# EAGLE design RingerPro2 (EAGLE 9.6.2)
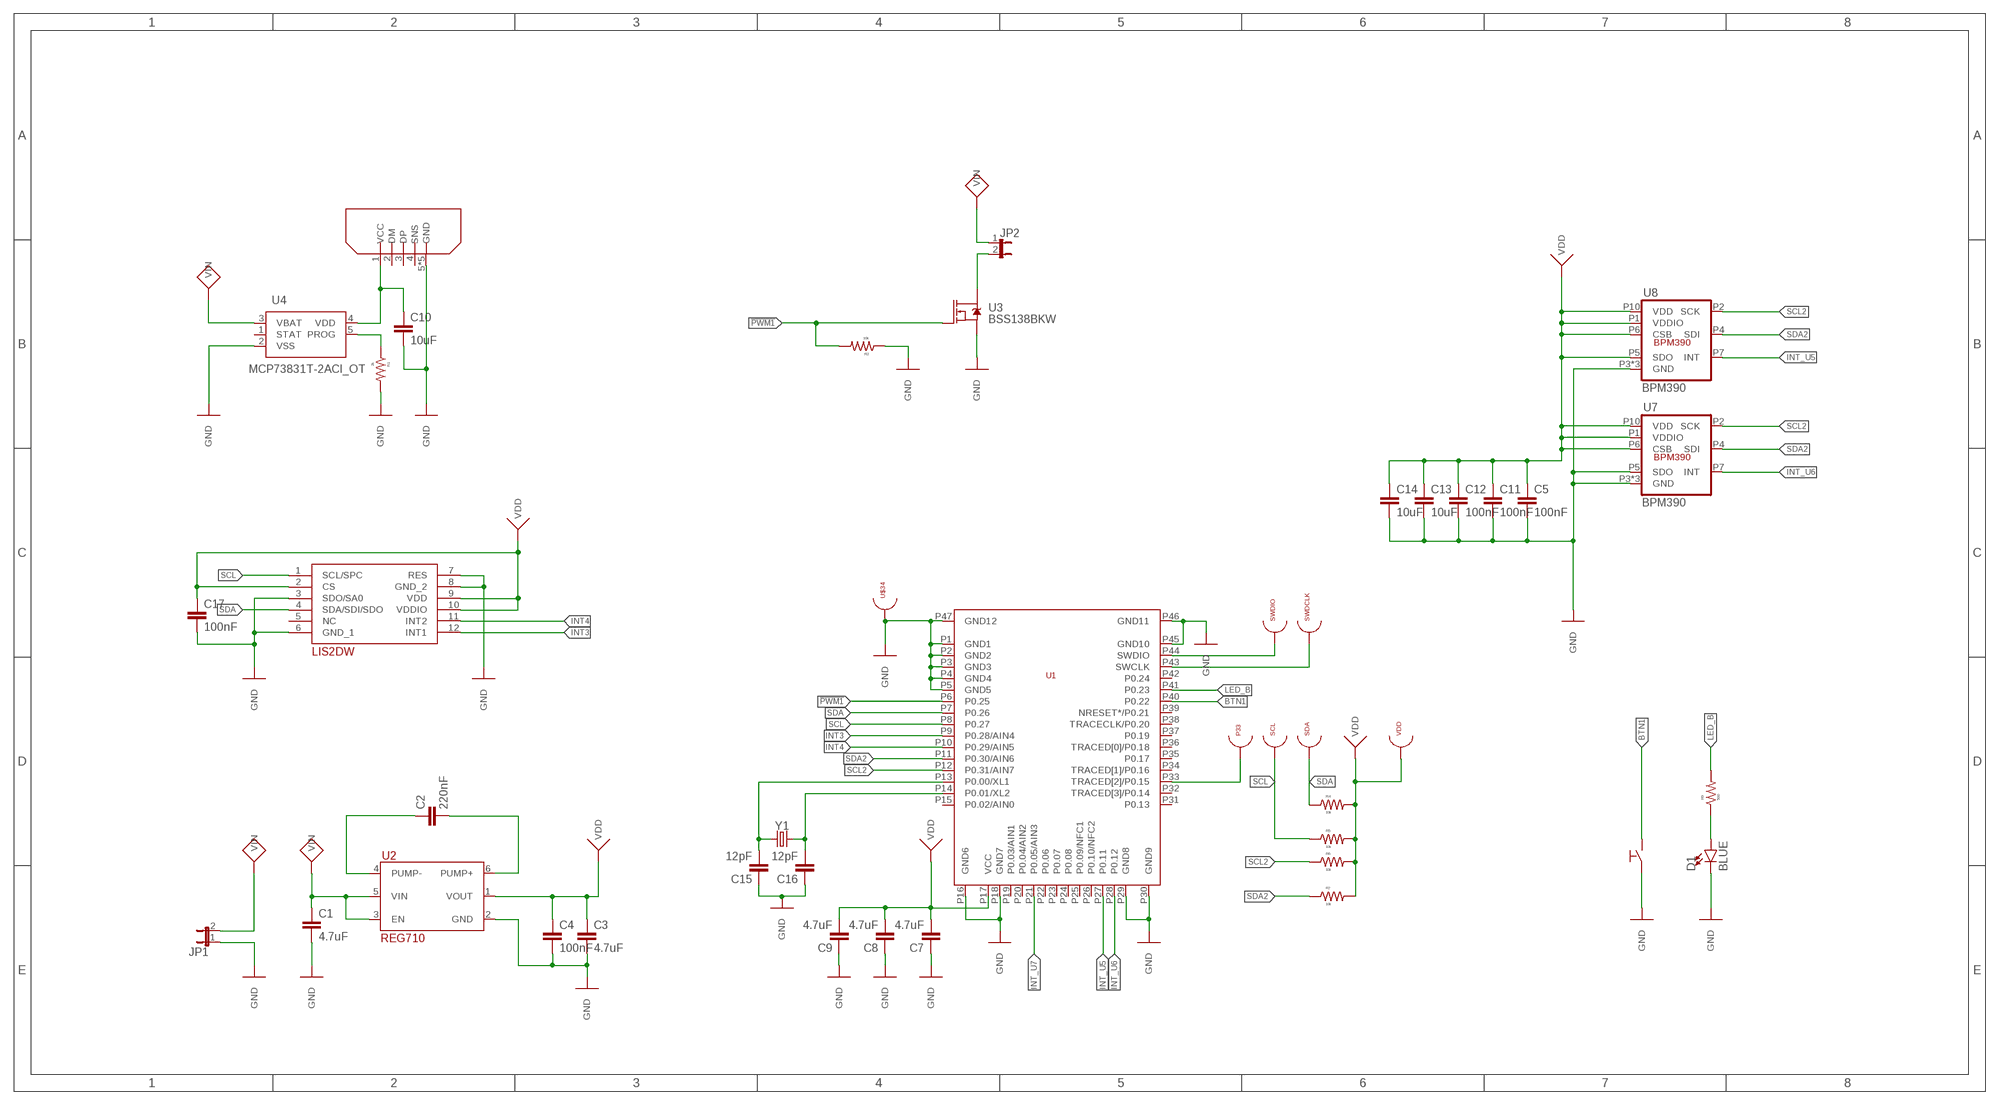
[diagram p0: schematic, sheet 1]

## Parts
C1  4.7uF  CAPACITOR0603  [C0603]
C2  220nF  CAPACITOR0603  [C0603]
C3  4.7uF  CAPACITOR0603  [C0603]
C4  100nF  CAPACITOR0603  [C0603]
C5  100nF  CAPACITOR0603  [C0603]
C7  4.7uF  CAPACITOR0603  [C0603]
C8  4.7uF  CAPACITOR0603  [C0603]
C9  4.7uF  CAPACITOR0603  [C0603]
C10  10uF  CAPACITOR0603  [C0603]
C11  100nF  CAPACITOR0603  [C0603]
C12  100nF  CAPACITOR0603  [C0603]
C13  10uF  CAPACITOR0603  [C0603]
C14  10uF  CAPACITOR0603  [C0603]
C15  12pF  CAPACITOR0603  [C0603]
C16  12pF  CAPACITOR0603  [C0603]
C17  100nF  CAPACITOR0603  [C0603]
D1  BLUE  LED-BLUE0603  [LED-0603]
IC1  LIS2DW12TR  [LGA-12]
JP1  JP1E  [JP1]
JP2  JP1E  [JP1]
P33  TESTPOINT_22  [TESTPOINT_22]
R1  2k  RESISTOR0603  [R0603]
R2  10k  RESISTOR0603  [R0603]
R4  10k  RESISTOR0603  [R0603]
R5  10k  RESISTOR0603  [R0603]
R6  10k  RESISTOR0603  [R0603]
R7  10k  RESISTOR0603  [R0603]
R9  500  RESISTOR0603  [R0603]
SCL  TESTPOINT_22  [TESTPOINT_22]
SDA  TESTPOINT_22  [TESTPOINT_22]
SPST1  PTS526SK08  [PTS526SKG15SMTR2LFS]
SWDCLK  TESTPOINT_22  [TESTPOINT_22]
SWDIO  TESTPOINT_22  [TESTPOINT_22]
U1  BMD-300  [BMD-300]
U2  REG710  [SOT457]
U3  BSS138BKW  [SOT65P210X110-3N]
U4  MCP73831T-2ACI_OT  [SOT95P270X145-5N]
U7  BPM390  [BPM390]
U8  BPM390  [BPM390]
U$23  ZX80B5P  [ZX80B5P]
U$34  TESTPOINT_22  [TESTPOINT_22]
VDD  TESTPOINT_22  [TESTPOINT_22]
Y1  CRYSTALSMD-3.2X1.5  [CRYSTAL-SMD-3.2X1.5MM]

## Nets
!PWM1: R2.2 U1.P6(P0.25) U3.1(G)
BTN1: SPST1.3 SPST1.4 U1.P40(P0.22)
GND: C1.2 C3.2 C4.2 C5.2 C7.1 C8.1 C9.1 C10.2 C11.2 C12.2 C13.2 C14.2 C15.1 C16.1 C17.2 D1.C IC1.3(SDO/SA0) IC1.6(GND_1) IC1.7(RES) IC1.8(GND_2) JP1.1 R1.2 R2.1 SPST1.1 SPST1.2 U1.P1(GND1) U1.P2(GND2) U1.P3(GND3) U1.P4(GND4) U1.P5(GND5) U1.P16(GND6) U1.P18(GND7) U1.P29(GND8) U1.P30(GND9) U1.P45(GND10) U1.P46(GND11) U1.P47(GND12) U2.2(GND) U3.2(S) U4.2(VSS) U7.P3(GND) U7.P5(SDO) U7.P8(GND) U7.P9(GND) U8.P3(GND) U8.P8(GND) U8.P9(GND) U$23.5(GND) U$23.GND1(GND) U$23.GND2(GND) U$23.GND3(GND) U$23.GND4(GND) U$34.P$1
INT3: IC1.12(INT1) U1.P9(P0.28/AIN4)
INT4: IC1.11(INT2) U1.P10(P0.29/AIN5)
INT_U5: U1.P27(P0.11) U8.P7(INT)
INT_U6: U1.P28(P0.12) U7.P7(INT)
INT_U7: U1.P21(P0.05/AIN3)
LED_B: R9.2 U1.P41(P0.23)
N$3: C2.1 U2.4(PUMP-)
N$4: C2.2 U2.6(PUMP+)
N$5: C10.1 U4.4(VDD) U$23.1(VCC)
N$6: C15.2 U1.P13(P0.00/XL1) Y1.P$1
N$7: R1.1 U4.5(PROG)
N$8: JP2.2 U3.3(D)
N$9: C16.2 U1.P14(P0.01/XL2) Y1.P$2
N$10: P33.P$1 U1.P33(TRACED[2]/P0.15)
N$11: D1.A R9.1
SCL: IC1.1(SCL/SPC) R5.1 SCL.P$1 U1.P8(P0.27)
SCL2: R6.1 U1.P12(P0.31/AIN7) U7.P2(SCK) U8.P2(SCK)
SDA: IC1.4(SDA/SDI/SDO) R4.1 SDA.P$1 U1.P7(P0.26)
SDA2: R7.1 U1.P11(P0.30/AIN6) U7.P4(SDI) U8.P4(SDI)
SWCLK: SWDCLK.P$1 U1.P43(SWCLK)
SWDIO: SWDIO.P$1 U1.P44(SWDIO)
VDD: C3.1 C4.1 C5.1 C7.2 C8.2 C9.2 C11.1 C12.1 C13.1 C14.1 C17.1 IC1.2(CS) IC1.9(VDD) IC1.10(VDDIO) R4.2 R5.2 R6.2 R7.2 U1.P17(VCC) U2.1(VOUT) U7.P1(VDDIO) U7.P6(CSB) U7.P10(VDD) U8.P1(VDDIO) U8.P5(SDO) U8.P6(CSB) U8.P10(VDD) VDD.P$1
VIN: C1.1 JP1.2 JP2.1 U2.3(EN) U2.5(VIN) U4.3(VBAT)
Unconnected: IC1.5(NC) U1.P15(P0.02/AIN0) U1.P19(P0.03/AIN1) U1.P20(P0.04/AIN2) U1.P22(P0.06) U1.P23(P0.07) U1.P24(P0.08) U1.P25(P0.09/NFC1) U1.P26(P0.10/NFC2) U1.P31(P0.13) U1.P32(TRACED[3]/P0.14) U1.P34(TRACED[1]/P0.16) U1.P35(P0.17) U1.P36(TRACED[0]/P0.18) U1.P37(P0.19) U1.P38(TRACECLK/P0.20) U1.P39(NRESET*/P0.21) U1.P42(P0.24) U4.1(STAT) U$23.2(DM) U$23.3(DP) U$23.4(SNS)

## Library data of the parts
C1-C5 C7-C17 = Passives:CAPACITOR: Capacitor
D1 = SparkFun-LED:LED-BLUE: Blue SMD LED Used in manufacturing of various products at SparkFun Packages: 0603 - SMD 0603 package [Product Link] <http://www.digikey.com/product-detail/en/SMLE12BC7TT86/511-1589-2-ND/1641808> 1206 - SMD1206 package [Product Link] <http://www.digikey.com/product-detail/en/lite-on-inc/LTST-C150TBKT/160-1643-1-ND/573584> SparkFun Products: ESP8266 Thing-Dev Board <https://www.sparkfun.com/products/13711> RedBoard <https://www.sparkfun.com/products/12757>; PROD_ID: DIO-08575
IC1 = Accelerometers:LIS2DW12TR: Accelerometers MEMS digital output motion sensor:high-performance ultra-low-power 3-axis "femto" accelerometer Source: Datasheet <https://componentsearchengine.com/Datasheets/1/LIS2DW12TR.pdf>; DESCRIPTION: Accelerometers MEMS digital output motion sensor:high-performance ultra-low-power 3-axis "femto" accelerometer; HEIGHT: mm; MANUFACTURER_NAME: STMicroelectronics; MANUFACTURER_PART_NUMBER: LIS2DW12TR; MOUSER_PART_NUMBER: 511-LIS2DW12TR; MOUSER_PRICE-STOCK: https://www.mouser.com/Search/Refine.aspx?Keyword=511-LIS2DW12TR
JP1 JP2 = jumper:JP1E: JUMPER
P33 SCL SDA SWDCLK SWDIO U$34 VDD = test_points:TESTPOINT_22
R1 R2 R4-R7 R9 = Passives:RESISTOR: Resistor
SPST1 = SPST:PTS526SK08: Interrupteurs de contact 50mA 12VDC, 5.2x5.2mm, 0.8mm H, 260gf, G leads, No ground pin, no actuator Button SPST; MTN: 611-PTS526SK08SMTR2L
U1 = Rigado:BMD-300
U2 = DCDC:REG710: REG710xx Buck-Boost Charge Pump with up to 60-mA Output Current
U3 = BSS138:BSS138BKW: N-channel Trench MOSFET; MPN: BSS138BKW; OC_FARNELL: 2053836; OC_NEWARK: 61T7488; PACKAGE: SOT-23-3; SUPPLIER: NXP
U4 = Battery:MCP73831T-2ACI_OT: Li-Ion Charge Controller 4.2V SOT23-5 Source: Datasheet <http://ww1.microchip.com/downloads/en/DeviceDoc/20001984g.pdf>; DESCRIPTION: Li-Ion Charge Controller 4.2V SOT23-5; HEIGHT: 1.45mm; MANUFACTURER_NAME: Microchip; MANUFACTURER_PART_NUMBER: MCP73831T-2ACI/OT; MOUSER_PART_NUMBER: 579-MCP73831T-2ACIOT; MOUSER_PRICE-STOCK: https://www.mouser.co.uk/ProductDetail/Microchip-Technology/MCP73831T-2ACI-OT?qs=yUQqVecv4qvbBQBGbHx0Mw%3D%3D
U7 U8 = Barometers:BPM390: High precision pressure sensor
U$23 = USB:ZX80B5P
Y1 = SparkFun-Clocks:CRYSTAL: Crystals (Generic) These are passive quartz crystals, which can be used as a clock source for a microcontroller. Crystal's are two-terminal devices. They require external "load" capacitors to generate an oscillating signal.

## Net classes
0 default: width 0.178 mm, clearance 0.152 mm

## Board
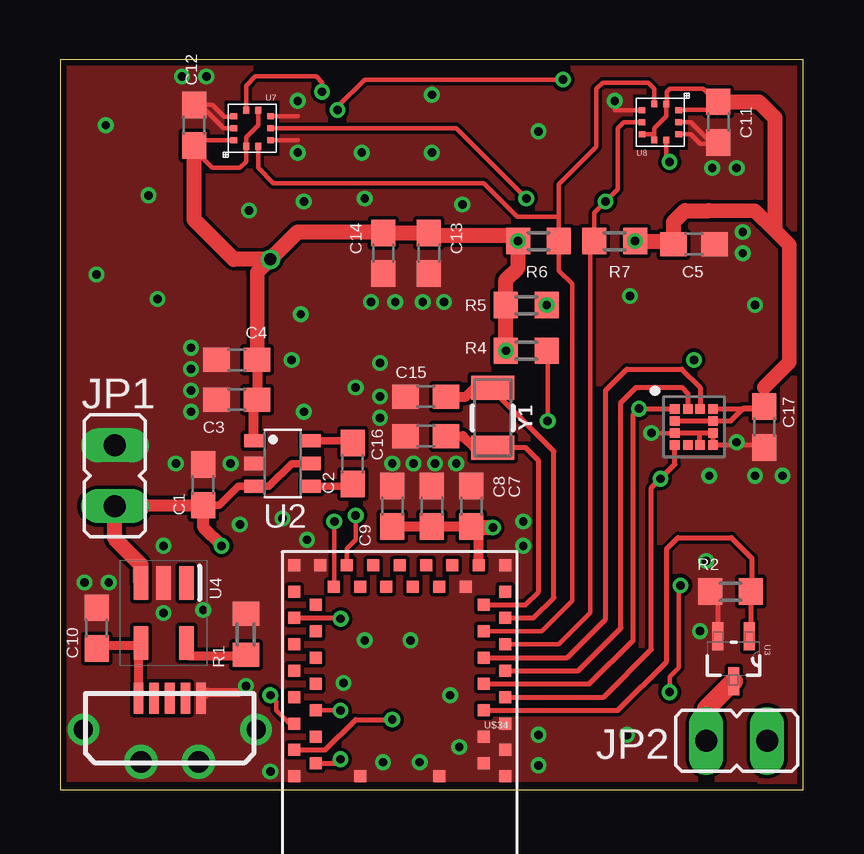
[diagram p1: board, top side]
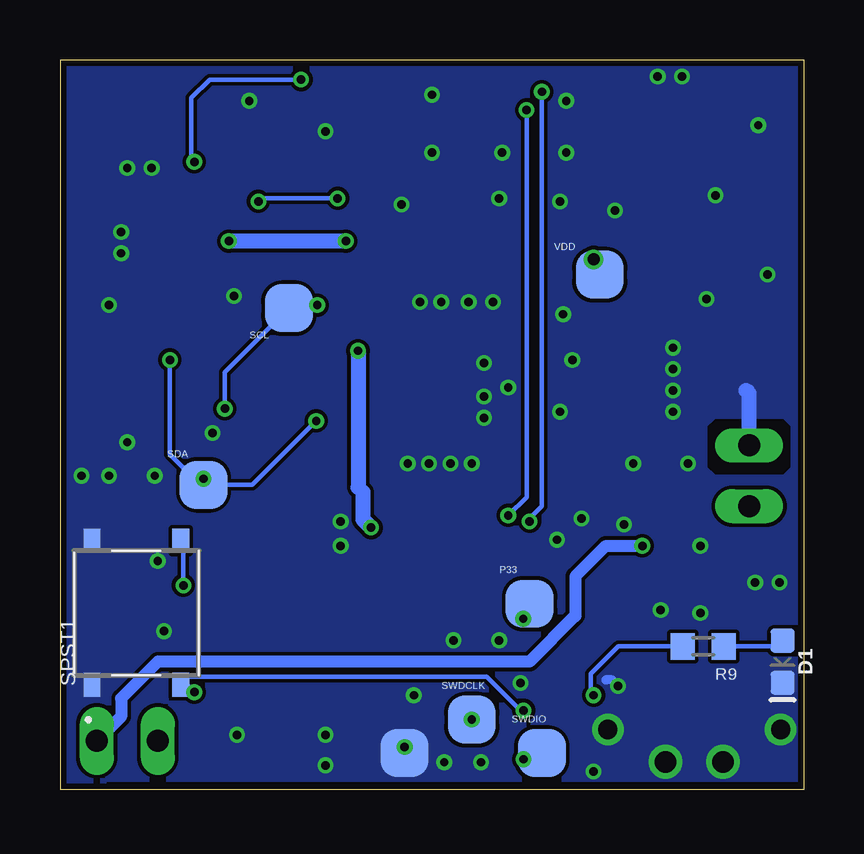
[diagram p2: board, bottom side, seen from below]

Size 30.97 x 30.4 mm. Coordinates in mm from the lower left corner, seen from the top.
Outline: 0,0 30.97,0 30.97,30.4 0,30.4 0,0
Copper layers (1*16): Top 0.035mm / dielectric 1.5mm / Bottom 0.035mm
Design rules "SeeedStudio_2layer_DRU_no_angle_20140221": minimum track width 6mil, minimum drill 12mil, track to track 6mil, track to pad 6mil, pad to pad 6mil, via to via 6mil, smd to smd 0mil, copper to edge 10mil, drill to drill 10mil, minimum pad ring 10mil, minimum via ring 6mil, stop-mask expansion 2mil, vias tented up to drill 100mil, thermal gap 10mil
tRestrict: area 6.9,26.4 to 9.1,28.7; area 23.9,26.7 to 26.2,29; area 25.1,13.8 to 27.7,16.4

### Footprints (pad centres in the part's own frame; a part is rotated, then mirrored left to right if it is on the bottom)
C0603 = smd 1.1 x 1: 1 -0.85,0; 2 0.85,0
LED-0603 = smd 1 x 1: A -0.877,0; C 0.877,0
LGA-12 = smd 0.4 x 0.4: 1 -0.8,0.75; 2 -0.8,0.25; 3 -0.8,-0.25; 4 -0.8,-0.75; 5 -0.25,-0.75; 6 0.25,-0.75; 7 0.8,-0.75; 8 0.8,-0.25; 9 0.8,0.25; 10 0.8,0.75; 11 0.25,0.75; 12 -0.25,0.75
JP1 = drill 0.914 long: 1 0,-1.27; 2 0,1.27
TESTPOINT_22 = smd 2 x 2: P$1 0,0
R0603 = smd 1 x 1.1: 1 -0.85,0; 2 0.85,0
PTS526SKG15SMTR2LFS = smd 1 x 0.7: 1 -3,1.85; 2 3,1.85; 3 -3,-1.85; 4 3,-1.85
BMD-300 = smd 0.5 x 0.5: P1 0.5,9.35; P2 1.4,8.8; P3 0.5,8.25; P4 1.4,7.7; P5 0.5,7.15; P6 1.4,6.6; P7 0.5,6.05; P8 1.4,5.5; P9 0.5,4.95; P10 1.4,4.4; P11 0.5,3.85; P12 1.4,3.3; P13 0.5,2.75; P14 1.4,2.2; P15 0.5,1.65; P16 0.5,0.55; P17 1.6,0.55; P18 2.15,1.45; P19 2.7,0.55; P20 3.25,1.45; P21 3.8,0.55; P22 4.35,1.45; P23 4.9,0.55; P24 5.45,1.45; P25 6,0.55; P26 6.55,1.45; P27 7.1,0.55; P28 7.65,1.45; P29 8.2,0.55; P30 9.3,0.55; P31 9.3,1.65; P32 8.4,2.2; P33 9.3,2.75; P34 8.4,3.3; P35 9.3,3.85; P36 8.4,4.4; P37 9.3,4.95; P38 8.4,5.5; P39 9.3,6.05; P40 8.4,6.6; P41 9.3,7.15; P42 8.4,7.7; P43 9.3,8.25; P44 8.4,8.8; P45 9.3,9.35; P46 6.55,9.35; P47 3.25,9.35
SOT457 = smd 0.55 x 0.8: 1 -0.95,-1.2; 2 0,-1.2; 3 0.95,-1.2; 4 0.95,1.2; 5 0,1.2; 6 -0.95,1.2
SOT65P210X110-3N = smd 1.168 x 0.457: 1 -0.94,0.66; 2 -0.94,-0.66; 3 0.94,0
SOT95P270X145-5N = smd 1.4 x 0.6: 1 -1.25,0.95; 2 -1.25,0; 3 -1.25,-0.95; 4 1.25,-0.95; 5 1.25,0.95
BPM390 = smd 0.25 x 0.275: P1 0.25,0.75; P2 -0.25,0.75; P6 -0.25,-0.75; P7 0.25,-0.75 | smd 0.275 x 0.25: P3 -0.762,0.5; P4 -0.762,0; P5 -0.762,-0.5; P8 0.762,-0.5; P9 0.762,0; P10 0.762,0.5
ZX80B5P = smd 0.4 x 1.3: 1 -1.3,0; 2 -0.65,0; 3 0,0; 4 0.65,0; 5 1.3,0 | drill 0.8: GND1 3.6,-1.3; GND4 -3.6,-1.3 | drill 0.9: GND2 -1.2,-2.65; GND3 1.2,-2.65
CRYSTAL-SMD-3.2X1.5MM = smd 1 x 1.8: P$1 -1.25,0; P$2 1.25,0

### Placement (x,y rotation side)
C1  5.97,12.7 90 top
C2  12.19,13.59 90 top
C3  7.37,16.26 180 top
C4  7.37,17.91 180 top
C5  26.42,22.73 0 top
C7  17.14,11.81 270 top
C8  15.49,11.81 270 top
C9  13.84,11.81 270 top
C10  1.52,6.73 90 top
C11  27.43,27.81 270 top
C12  5.59,27.69 90 top
C13  15.37,22.35 270 top
C14  13.46,22.35 270 top
C15  15.24,16.38 0 top
C16  15.24,14.73 0 top
C17  29.34,15.11 270 top
D1  0.89,5.33 270 bottom
IC1  26.42,15.11 0 top
JP1  2.29,13.08 180 top
JP2  28.19,2.03 90 top
P33  11.43,7.75 0 bottom
R1  7.75,6.48 90 top
R2  27.94,8.26 0 top
R4  19.43,18.29 180 top
R5  19.43,20.19 180 top
R6  19.94,22.86 180 top
R7  23.11,22.86 0 top
R9  4.19,5.97 180 bottom
SCL  21.46,20.07 0 bottom
SDA  25.02,12.7 0 bottom
SPST1  27.81,7.37 90 bottom
SWDCLK  13.84,2.92 0 bottom
SWDIO  10.92,1.52 0 bottom
U1  19.05,9.91 180 top
U2  9.27,13.59 270 top
U3  28.07,5.46 270 top
U4  4.32,7.37 270 top
U7  8,27.56 180 top
U8  25.02,27.81 0 top
U$23  4.57,3.81 0 top
U$34  16.64,1.52 0 bottom
VDD  8.51,21.46 0 bottom
Y1  18.03,15.49 270 top

### Tracks (layer width: path | path; a pad name or v marks a point on that pad's centre or on a via)
!PWM1
  Top 0.203: U1.P6 23.25,3.31 25.27,5.33 25.27,10.03 25.74,10.5 27.98,10.5 28.83,9.65 28.83,8.29 R2.2 28.79,6.46 U3.1
BTN1  (via drill 0.35)
  Top 0.178: v11.68,3.3 U1.P40 | v25.4,4.06 25.4,4.7 25.78,5.08 25.78,8.51 v25.85,8.51
  Bottom 0.178: v11.68,3.3 11.81,3.3 13.21,4.7 25.63,4.7 SPST1.3 25.7,4.37 v25.4,4.06 | v25.85,8.51 25.85,10.26 SPST1.4
GND  (via drill 0.35)
  Top 0.178: C5.2 27.16,22.62 27.18,22.61 | IC1.3 v24.64,14.86 | 5.84,28.54 6.35,28.54 6.84,28.05 7.23,28.05 U7.P8 | 5.84,28.54 C12.2 | U8.P8 26.28,27.31 26.67,26.92 27.39,26.92 C11.2 27.14,26.96 26.29,27.81 U8.P9 | 5.84,28.54 6.82,27.56 U7.P9 | U7.P5 8.77,28.07 9.91,28.07 | U7.P3 9.9,27.06 9.91,27.05 | U8.P3 23.12,28.31 23.11,28.32
  Top 0.203: IC1.3 26.67,14.86 | 26.67,14.86 IC1.8 IC1.7 29.36,14.36 | IC1.6 26.67,14.86 | R2.1 27.41,7.94 U3.2
  Top 0.381: U$23.5 6.13,4.06 7.49,4.06 v7.75,4.32
  Bottom 0.381: v7.75,4.32 8,4.57 8.26,4.57
  Bottom 0.635: JP1.1 2.29,16.51 2.41,16.64
  other vias: 30.1,13.08 28.96,13.08 27.05,13.08 16.51,13.59 15.62,13.59 14.73,13.59 13.84,13.59 5.46,18.41 5.46,17.53 5.46,16.64 13.34,17.78 12.32,16.76 5.46,15.75 7.11,13.59 4.83,13.59 5.97,7.49 4.32,7.37 1.02,8.64 8.76,0.76 13.46,1.14 14.99,1.14 19.94,2.29 19.94,1.02 16.64,1.78 14.61,6.22 19.3,10.16 10.29,10.41 7.49,11.05 4.06,20.45 13.34,16.38 13.34,15.49 9.27,11.3 4.32,10.16 2.03,8.64 12.7,6.22 16.26,3.94 11.81,4.45 23.62,2.29 19.3,11.18 9.65,17.91 1.52,21.46 10.16,15.75 28.19,14.48 12.95,20.32 13.97,20.32 15.11,20.32 16,20.32 28.45,22.35 28.45,23.24 5.08,29.72 6.1,29.72 12.57,26.54 15.49,26.54 15.49,28.96 19.94,27.43 7.87,24.13 3.68,24.77 1.91,27.69 10.03,19.81 28.96,20.19 12.7,24.64 16.76,24.38 10.16,24.51 23.75,20.57 28.19,25.91 27.18,25.91 26.92,9.53 26.67,6.6 23.11,28.7 9.91,28.7 9.91,26.54
  pour Bottom (no thermals): -1.78,-1.14 -1.78,31.24 -0.64,32.38 31.88,32.38 33.66,30.61 33.66,-1.4 31.88,-3.17 0.25,-3.17
  pour Top (no thermals): -1.52,-1.4 -1.52,30.99 -0.38,32.13 32.13,32.13 33.91,30.35 33.91,-1.65 32.13,-3.43 0.51,-3.43
  cutout Bottom: 0.64,13.46 0.64,15.11 0.89,15.37 3.68,15.37 3.94,15.11 3.94,13.46 3.68,13.21 0.89,13.21
INT3
  Top 0.203: U1.P9 21.59,4.96 23.37,6.73 23.37,16.13 24,16.76 25.91,16.76 26.17,16.51 IC1.12
INT4
  Top 0.203: U1.P10 21.13,5.51 22.73,7.11 22.73,16.64 23.62,17.53 25.91,17.53 26.67,16.76 IC1.11
INT_U5  (via drill 0.35)
  Top 0.178: v11.56,28.32 11.56,28.45 12.7,29.59 v20.95,29.59 | v12.32,11.43 12.32,10.41 11.94,10.03 11.94,9.37 U1.P27 | v25.4,26.16 25.27,26.29 U8.P7
  Bottom 0.178: v11.56,28.32 11.56,12.19 v12.32,11.43 | v20.95,29.59 24.77,29.59 25.53,28.83 25.53,26.16 v25.4,26.16
INT_U6  (via drill 0.35)
  Top 0.178: v10.92,29.08 10.92,29.46 10.67,29.72 8.13,29.72 7.75,29.34 U7.P7 | v11.43,11.18 11.43,8.49 U1.P28
  Bottom 0.178: v10.92,29.08 10.92,11.81 11.43,11.3 v11.43,11.18
LED_B  (via drill 0.35)
  Top 0.178: v8.76,3.94 9.02,3.68 9.02,3.3 9.56,2.76 U1.P41
  Bottom 0.178: R9.2 7.75,5.97 8.89,4.83 8.89,4.06 v8.76,3.94
N$3
  Top 0.305: U2.4 12.09,12.64 C2.1
N$4
  Top 0.305: U2.6 12.09,14.54 C2.2
N$5
  Top 0.381: U$23.1 3.27,6.02 | 3.27,6.02 U4.4 | C10.1 1.66,6.02 3.27,6.02
N$6
  Top 0.203: U1.P13 19.73,7.16 20.57,8 20.57,14.1 17.91,16.76 | 17.91,16.76 18.05,16.76 Y1.P$1 | 17.91,16.76 17.29,16.76
  Top 0.406: 17.29,16.76 16.91,16.38 C15.2
N$7
  Top 0.381: U4.5 5.33,6.05 5.33,5.59 7.71,5.59 R1.1
N$8
  Top 0.762: U3.3 26.92,3.38 JP2.2
N$9
  Top 0.203: U1.P14 19.39,7.71 19.94,8.26 19.94,13.72 19.41,14.24 18.29,14.24 Y1.P$2 17.27,14.24
  Top 0.406: C16.2 16.78,14.73 17.27,14.24
N$10  (via drill 0.35)
  Top 0.203: U1.P33 11.66,7.16 v11.69,7.12
  Bottom 0.203: v11.69,7.12 11.69,7.48 P33.P$1
N$11
  Bottom 0.178: D1.A 1.13,5.97 R9.1
SCL  (via drill 0.35)
  Top 0.203: U1.P8 22.06,4.41 23.88,6.22 23.88,15.62 v24.13,15.88 25.6,15.88 IC1.1
  Bottom 0.178: v24.13,15.88 24.13,17.4 21.34,20.19 R5.1 20.41,20.07 SCL.P$1
  other vias: 20.28,20.19
SCL2
  Top 0.178: U1.P12 20.07,6.61 21.34,7.87 21.34,21.08 20.79,21.63 R6.1 20.79,23.88 | 20.79,23.88 20.79,25.23 22.35,26.8 22.35,29.21 22.61,29.46 24.51,29.46 24.77,29.21 U8.P2 | 20.79,23.88 19.05,23.88 17.65,25.27 8.89,25.27 8.25,25.91 U7.P2
SDA  (via drill 0.35)
  Top 0.178: R4.1 20.36,18.2 20.32,18.16 v20.32,15.37
  Top 0.203: U1.P7 22.65,3.86 24.64,5.84 24.64,12.57 v25.02,12.95 25.62,13.55 IC1.4 | 20.36,18.2 20.54,18.03
  Bottom 0.178: v26.42,17.91 26.42,13.97 25.21,12.76 v25.02,12.95 SDA.P$1 22.99,12.7 v20.32,15.37
SDA2  (via drill 0.35)
  Top 0.178: U1.P11 20.79,6.06 22.1,7.37 22.1,22.69 R7.1 22.26,24.04 v22.73,24.51 23.24,25.02 23.24,27.56 23.5,27.81 U8.P4 | v19.43,24.64 16.51,27.56 U7.P4
  Bottom 0.178: v22.73,24.51 22.61,24.64 v19.43,24.64
SWCLK  (via drill 0.35)
  Top 0.203: U1.P43 11.05,1.66 12.32,2.92 SWDCLK.P$1
  other vias: 13.84,2.92
SWDIO  (via drill 0.35)
  Top 0.203: U1.P44 11.52,1.11 v11.68,1.27
  Bottom 0.203: SWDIO.P$1 11.18,1.27 v11.68,1.27
VDD  (via drill 0.35, 0.51)
  Top 0.178: C5.1 25.53,22.69 25.53,22.61 | U8.P10 25.79,28.32 27.09,28.32 27.39,28.62 | 27.39,28.62 C11.1 | 27.39,28.62 26.8,29.21 25.4,29.21 25.27,29.08 U8.P1 25.27,28.06 24.77,27.56 24.77,27.3 | U7.P10 5.8,27.05 C12.1 5.59,26.67 6.35,25.91 7.49,25.91 7.75,26.17 U7.P1 7.75,27.18 8.26,27.69 U7.P6 | 24.77,27.3 U8.P6 | U8.P5 24.76,27.31 24.77,27.3
  Top 0.203: IC1.10 28.45,15.86 27.95,15.36 IC1.9 IC1.2
  Top 0.254: 28.45,15.86 29.36,15.86 29.36,15.94 C17.1 29.34,16.76
  Top 0.406: U1.P17 17.45,10.66 C7.2 C8.2 C9.2 | C4.1 C3.1 8.07,16.11 U2.1
  Top 0.61: 27.05,24.13 28.96,24.13 29.78,23.3 30.39,22.7 30.39,17.82 29.34,16.76 | v8.76,22.1 8.22,21.55 C4.1
  Top 0.635: R4.2 R5.2 18.58,21.25 19.09,21.76 R6.2 18.87,23.07 15.49,23.07 C13.1 C14.1 13.42,23.24 9.91,23.24 v8.76,22.1 7.24,22.1 5.59,23.75 C12.1 | C5.1 25.57,23.66 26.04,24.13 27.05,24.13 | R7.2 25.27,22.86 25.53,22.61 | v18.03,10.92 17.18,10.92 C7.2 | C11.1 29.12,28.66 29.78,28 29.78,23.3
  Bottom 0.635: VDD.P$1 8.76,21.72 v8.76,22.1 | R6.2 R7.2 | R4.2 18.58,12.6 18.38,12.39 18.38,11.27 v18.03,10.92
  other vias: 19.09,22.86 23.96,22.86 18.58,18.29
VIN  (via drill 0.36)
  Top 0.305: C1.1 6.64,11.85 7.43,12.64 U2.3 8.7,12.64 9.65,13.59 U2.5
  Top 0.508: JP1.2 2.33,11.85 C1.1 5.97,10.92 v6.73,10.16
  Top 0.635: U4.3 3.37,9.38 2.29,10.46 JP1.2
  Bottom 0.508: v6.73,10.16 8.26,10.16 9.53,8.89 9.53,7.24 11.43,5.33 26.92,5.33 28.45,3.81 28.45,3.05 JP2.1